# EAGLE design 640mk4 (EAGLE 7.5.0)
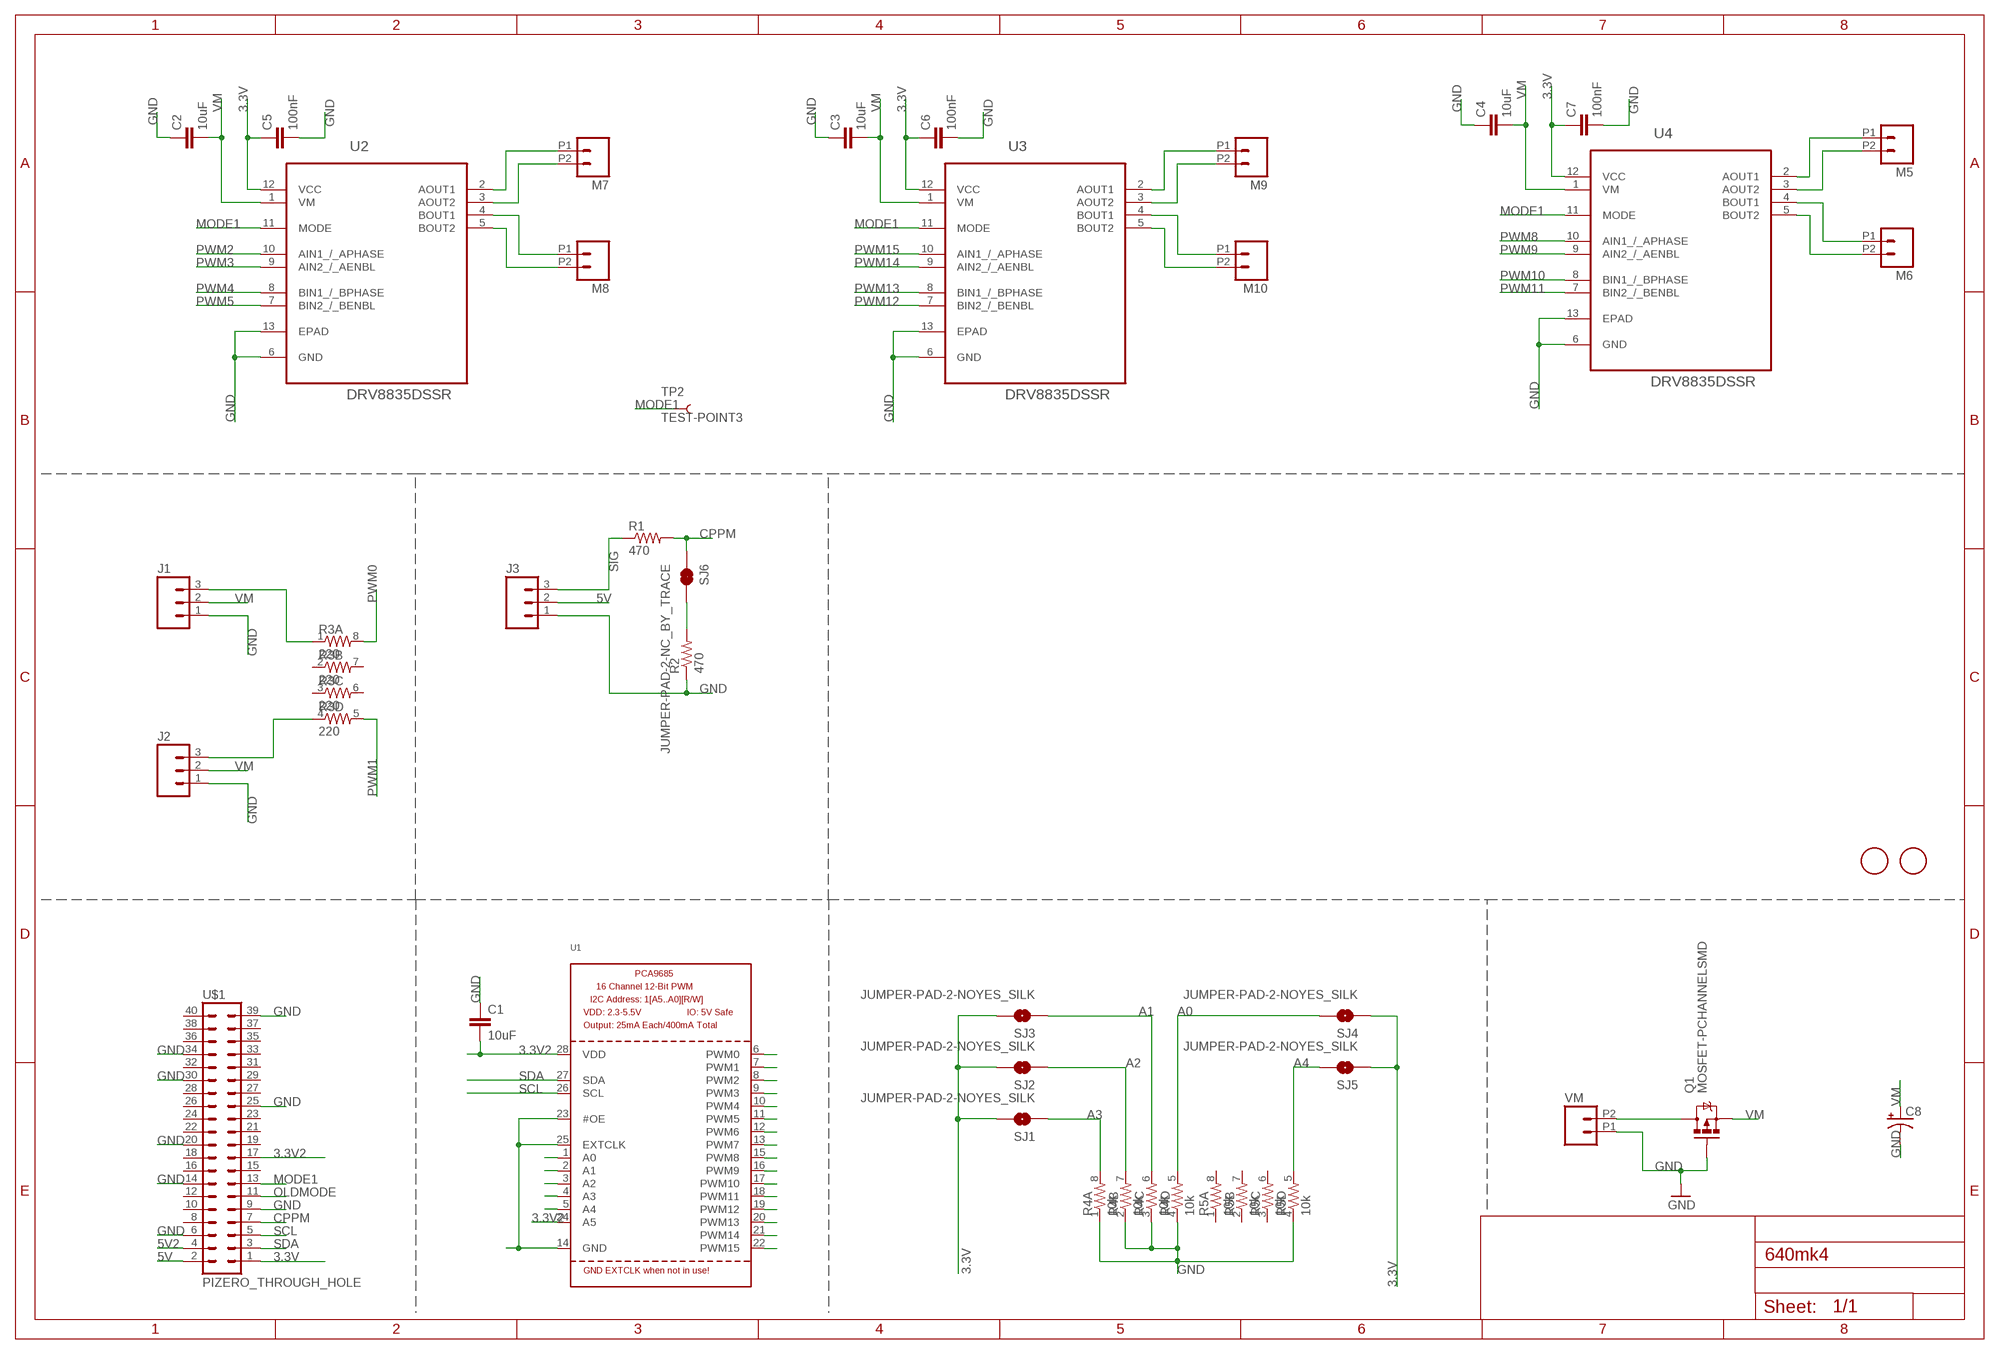
[diagram p0: schematic, sheet 1]

## Parts
C1  10uF  CAP0805  [0805]
C2  10uF  CAP0805  [0805]
C3  10uF  CAP0805  [0805]
C4  10uF  CAP0805  [0805]
C5  100nF  CAP0805  [0805]
C6  100nF  CAP0805  [0805]
C7  100nF  CAP0805  [0805]
C8  CAP_POLPTH1  [CPOL-RADIAL-100UF-25V]
FID1  FIDUCIAL  [FIDUCIAL_1MM]
FID2  FIDUCIAL  [FIDUCIAL_1MM]
J1  M03LOCK  [1X03_LOCK]
J2  M03LOCK  [1X03_LOCK]
J3  M03LOCK  [1X03_LOCK]
M5  M022.54MM_SCREWTERM  [1X02_2.54_SCREWTERM]
M6  M022.54MM_SCREWTERM  [1X02_2.54_SCREWTERM]
M7  M022.54MM_SCREWTERM  [1X02_2.54_SCREWTERM]
M8  M022.54MM_SCREWTERM  [1X02_2.54_SCREWTERM]
M9  M022.54MM_SCREWTERM  [1X02_2.54_SCREWTERM]
M10  M022.54MM_SCREWTERM  [1X02_2.54_SCREWTERM]
Q1  MOSFET-PCHANNELSMD  [SOT23-3]
R1  470  RESISTOR0805-RES  [0805]
R2  470  RESISTOR0805-RES  [0805]
R3  220  RESISTOR-ARRAY0603-ARV  [0603-ARV]
R4  10k  RESISTOR-ARRAY0603-ARV  [0603-ARV]
R5  10k  RESISTOR-ARRAY0603-ARV  [0603-ARV]
SJ1  JUMPER-PAD-2-NOYES_SILK  [PAD-JUMPER-2-NO_YES_SILK]
SJ2  JUMPER-PAD-2-NOYES_SILK  [PAD-JUMPER-2-NO_YES_SILK]
SJ3  JUMPER-PAD-2-NOYES_SILK  [PAD-JUMPER-2-NO_YES_SILK]
SJ4  JUMPER-PAD-2-NOYES_SILK  [PAD-JUMPER-2-NO_YES_SILK]
SJ5  JUMPER-PAD-2-NOYES_SILK  [PAD-JUMPER-2-NO_YES_SILK]
SJ6  JUMPER-PAD-2-NC_BY_TRACE  [PAD-JUMPER-2-NC_BY_TRACE_YES_SILK]
TP2  TEST-POINT3  [PAD.03X.03]
U1  PCA9685  [TSSOP28]
U2  DRV8835DSSR  [SON50P200X300X80-13N]
U3  DRV8835DSSR  [SON50P200X300X80-13N]
U4  DRV8835DSSR  [SON50P200X300X80-13N]
U$1  PIZERO_THROUGH_HOLE  [PIZERO_THOUGH_HOLE]
VM  M022.54MM_SCREWTERM  [1X02_2.54_SCREWTERM]

## Nets
3.3V: C5.1 C6.1 C7.1 SJ1.2 SJ2.2 SJ3.2 SJ4.1 SJ5.1 U2.12(VCC) U3.12(VCC) U4.12(VCC) U$1.1
3.3V2: C1.2 U1.24(A5) U1.28(VDD) U$1.17
5V: J3.2 U$1.2
5V2: U$1.4
A0: R4.5 SJ4.2 U1.1(A0)
A1: R4.6 SJ3.1 U1.2(A1)
A2: R4.7 SJ2.1 U1.3(A2)
A3: R4.8 SJ1.1 U1.4(A3)
A4: R5.5 SJ5.2 U1.5(A4)
CPPM: R1.2 SJ6.1 U$1.7
GND: C1.1 C2.1 C3.1 C4.1 C5.2 C6.2 C7.2 C8.2(-) J1.1 J2.1 J3.1 Q1.1(G) R2.1 R4.1 R4.2 R4.3 R4.4 R5.4 U1.14(GND) U1.23(#OE) U1.25(EXTCLK) U2.6(GND) U2.13(EPAD) U3.6(GND) U3.13(EPAD) U4.6(GND) U4.13(EPAD) U$1.6 U$1.9 U$1.14 U$1.20 U$1.25 U$1.30 U$1.34 U$1.39 VM.P1
MODE1: TP2.P$1 U2.11(MODE) U3.11(MODE) U4.11(MODE) U$1.13
N$1: R2.2 SJ6.2
N$2: J2.3 R3.4
N$4: J1.3 R3.1
N$5: Q1.3(D) VM.P2
N$10: M6.P2 U4.5(BOUT2)
N$11: M6.P1 U4.4(BOUT1)
N$12: M5.P2 U4.3(AOUT2)
N$13: M5.P1 U4.2(AOUT1)
N$14: M8.P2 U2.5(BOUT2)
N$15: M8.P1 U2.4(BOUT1)
N$16: M7.P2 U2.3(AOUT2)
N$17: M7.P1 U2.2(AOUT1)
N$18: M10.P2 U3.5(BOUT2)
N$19: M10.P1 U3.4(BOUT1)
N$20: M9.P2 U3.3(AOUT2)
N$21: M9.P1 U3.2(AOUT1)
OLDMODE: U$1.11
PWM0: R3.8 U1.6(PWM0)
PWM1: R3.5 U1.7(PWM1)
PWM2: U1.8(PWM2) U2.10(AIN1_/_APHASE)
PWM3: U1.9(PWM3) U2.9(AIN2_/_AENBL)
PWM4: U1.10(PWM4) U2.8(BIN1_/_BPHASE)
PWM5: U1.11(PWM5) U2.7(BIN2_/_BENBL)
PWM6: U1.12(PWM6)
PWM7: U1.13(PWM7)
PWM8: U1.15(PWM8) U4.10(AIN1_/_APHASE)
PWM9: U1.16(PWM9) U4.9(AIN2_/_AENBL)
PWM10: U1.17(PWM10) U4.8(BIN1_/_BPHASE)
PWM11: U1.18(PWM11) U4.7(BIN2_/_BENBL)
PWM12: U1.19(PWM12) U3.7(BIN2_/_BENBL)
PWM13: U1.20(PWM13) U3.8(BIN1_/_BPHASE)
PWM14: U1.21(PWM14) U3.9(AIN2_/_AENBL)
PWM15: U1.22(PWM15) U3.10(AIN1_/_APHASE)
SCL: U1.26(SCL) U$1.5
SDA: U1.27(SDA) U$1.3
SIG: J3.3 R1.1
VM: C2.2 C3.2 C4.2 C8.1(+) J1.2 J2.2 Q1.2(S) U2.1(VM) U3.1(VM) U4.1(VM)
Unconnected: R3.2 R3.3 R3.6 R3.7 R5.1 R5.2 R5.3 R5.6 R5.7 R5.8 U$1.8 U$1.10 U$1.12 U$1.15 U$1.16 U$1.18 U$1.19 U$1.21 U$1.22 U$1.23 U$1.24 U$1.26 U$1.27 U$1.28 U$1.29 U$1.31 U$1.32 U$1.33 U$1.35 U$1.36 U$1.37 U$1.38 U$1.40

## Library data of the parts
C1-C7 = SparkFun-Passives:CAP: Capacitor Standard 0603 ceramic capacitor, and 0.1" leaded capacitor.
C8 = SparkFun-Passives:CAP_POL: Capacitor Polarized These are standard SMD and PTH capacitors. Normally 10uF, 47uF, and 100uF in electrolytic and tantalum varieties. Always verify the external diameter of the through hole cap, it varies with capacity, voltage, and manufacturer. The EIA devices should be standard.
FID1 FID2 = adafruit:FIDUCIAL: For use by pick and place machines to calibrate the vision/machine, 1mm By microbuilder.eu
J1-J3 = SparkFun-Connectors:M03: Header 3 Standard 3-pin 0.1" header. Use with straight break away headers (SKU : PRT-00116), right angle break away headers (PRT-00553), swiss pins (PRT-00743), machine pins (PRT-00117), and female headers (PRT-00115). Molex polarized connector foot print use with SKU : PRT-08232 with associated crimp pins and housings.
M5-M10 VM = SparkFun-Connectors:M02: Standard 2-pin 0.1" header. Use with - straight break away headers ( PRT-00116) - right angle break away headers (PRT-00553) - swiss pins (PRT-00743) - machine pins (PRT-00117) - female headers (PRT-00115) Molex polarized connector foot print use with: PRT-08233 with associated crimp pins and housings. 2.54_SCREWTERM for use with PRT-10571. 3.5mm Screw Terminal footprints for PRT-08084 5mm Screw Terminal footprints for use with PRT-08432
Q1 = SparkFun-DiscreteSemi:MOSFET-PCHANNEL: Generic PMOSFET IRLML2244 - TRANS-11153 (SOT-23 -20V -4.3A) (1.Gate 2.Source 3.Drain) FQP27P06 - COM-10349 <http://www.sparkfun.com/products/10349> (TO-220 -60V -27A) (1.Gate 2.Source 3.Drain)
R1 R2 = SparkFun-Passives:RESISTOR: Resistor Basic schematic elements and footprints for 0603, 1206, and PTH resistors.
R3-R5 = SparkFun-Passives:RESISTOR-ARRAY: Array Chip Resistor Source: RS Component / Phycomp
SJ1-SJ5 = SparkFun-Passives:JUMPER-PAD-2-NO
SJ6 = SparkFun-Passives:JUMPER-PAD-2-NC_BY_TRACE
TP2 = SparkFun-Passives:TEST-POINT: Bare copper test points for troubleshooting or ICT
U1 = adafruit:PCA9685: PCA9685 - 16 Channel 12-Bit I2C PWM Controller 5.0V tolerant 16 channel, 12-bit I2C PWM controller with 25mA per output (max. 400mA total) Digikey: 568-5931-1-ND
U2-U4 = drv8835:DRV8835DSSR: DUAL LOW VOLTAGE H-BRIDGE IC,SON-12; MPN: DRV8835DSSR; OC_FARNELL: 2115235; OC_NEWARK: 94T6065; PACKAGE: SON-12; SUPPLIER: TEXAS INSTRUMENTS
U$1 = pizero:PIZERO_THROUGH_HOLE

## Board
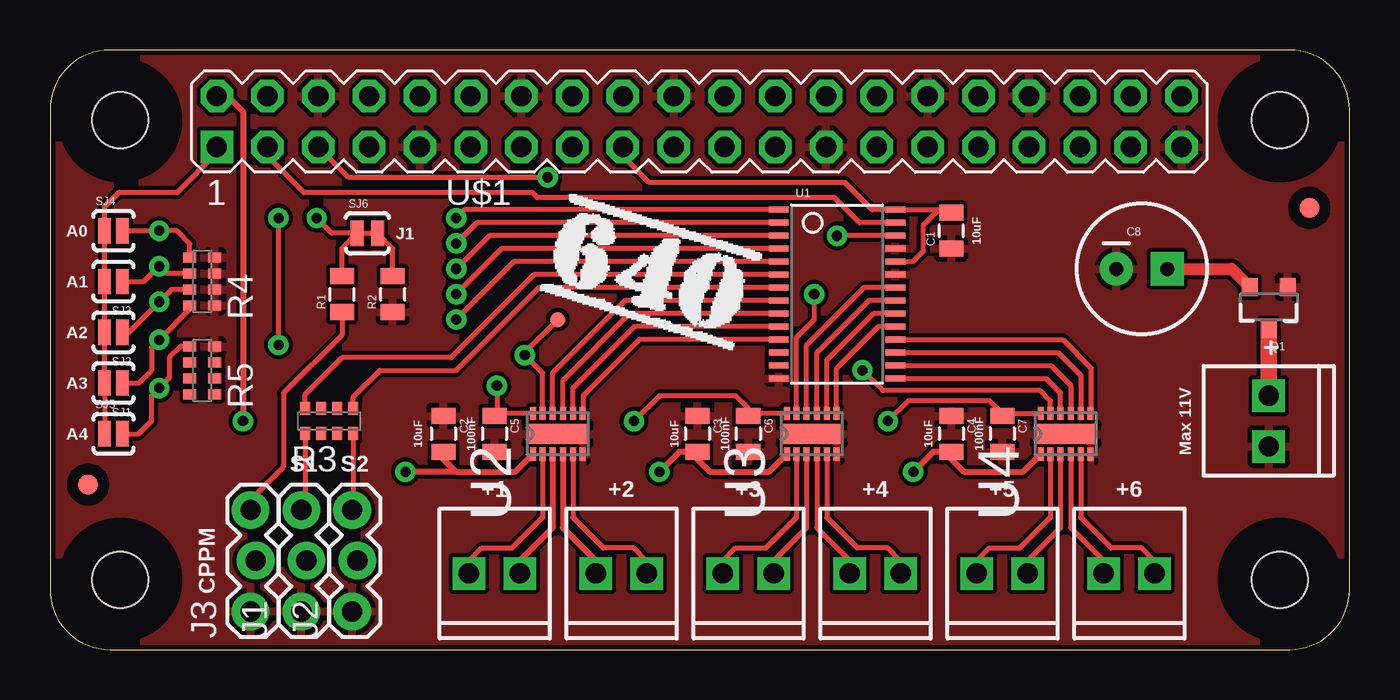
[diagram p1: board, top side]
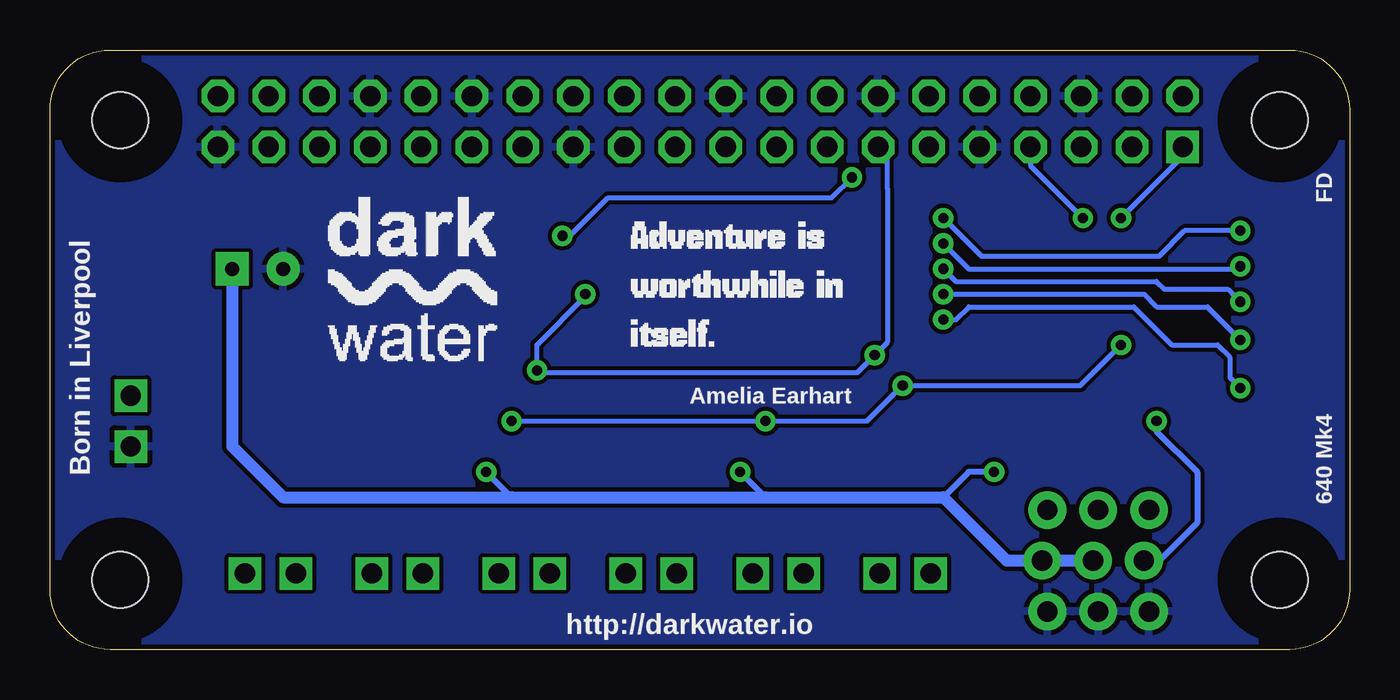
[diagram p2: board, bottom side, seen from below]

Size 65 x 30 mm. Coordinates in mm from the lower left corner, seen from the top.
Copper layers (1*16): Top 0.035mm / dielectric 1.5mm / Bottom 0.035mm
Design rules "SparkFun": minimum track width 8mil, minimum drill 20mil, track to track 8mil, track to pad 8mil, pad to pad 8mil, via to via 8mil, smd to smd 8mil, copper to edge 10mil, drill to drill 8mil, minimum pad ring 12mil, minimum via ring 10mil, stop-mask expansion 4mil, vias tented up to drill 25mil, thermal gap 10mil

### Footprints (pad centres in the part's own frame; a part is rotated, then mirrored left to right if it is on the bottom)
0805 = smd 0.8 x 1.2: 1 -0.9,0; 2 0.9,0
CPOL-RADIAL-100UF-25V = drill 0.7 pad 1.651 square: 1 1.27,0 | drill 0.7 pad 1.651: 2 -1.27,0
FIDUCIAL_1MM = smd 1 x 1: 1 0,0
1X03_LOCK = drill 1.016 pad 1.88: 1 0,0.127; 2 2.54,-0.127; 3 5.08,0.127
1X02_2.54_SCREWTERM = drill 1.016 square: P1 2.54,0; P2 0,0
SOT23-3 = smd 0.8 x 0.9: 1 -0.95,-1; 2 0.95,-1; 3 0,1.1
0603-ARV = smd 0.5 x 0.65: 1 -1.2,-0.625; 2 -0.4,-0.625; 3 0.4,-0.625; 4 1.2,-0.625; 5 1.2,0.625; 6 0.4,0.625; 7 -0.4,0.625; 8 -1.2,0.625
PAD-JUMPER-2-NO_YES_SILK = smd 0.635 x 1.27: 1 -0.45,0; 2 0.45,0
PAD-JUMPER-2-NC_BY_TRACE_YES_SILK = smd 0.635 x 1.27: 1 -0.508,0; 2 0.508,0
PAD.03X.03 = smd 0.762 x 0.762: P$1 0,0
TSSOP28 = smd 0.305 x 0.991: 1 -4.225,-2.918; 2 -3.575,-2.918; 3 -2.925,-2.918; 4 -2.275,-2.918; 5 -1.625,-2.918; 6 -0.975,-2.918; 7 -0.325,-2.918; 8 0.325,-2.918; 9 0.975,-2.918; 10 1.625,-2.918; 11 2.275,-2.918; 12 2.925,-2.918; 13 3.575,-2.918; 14 4.225,-2.918; 15 4.225,2.918; 16 3.575,2.918; 17 2.925,2.918; 18 2.275,2.918; 19 1.625,2.918; 20 0.975,2.918; 21 0.325,2.918; 22 -0.325,2.918; 23 -0.975,2.918; 24 -1.625,2.918; 25 -2.275,2.918; 26 -2.925,2.918; 27 -3.575,2.918; 28 -4.225,2.918
SON50P200X300X80-13N = smd 0.66 x 0.305: 1 -1.016,1.245; 2 -1.016,0.762; 3 -1.016,0.254; 4 -1.016,-0.254; 5 -1.016,-0.762; 6 -1.016,-1.245; 7 1.016,-1.245; 8 1.016,-0.762; 9 1.016,-0.254; 10 1.016,0.254; 11 1.016,0.762; 12 1.016,1.245 | smd 0.991 x 3.099: 13 0,0
PIZERO_THOUGH_HOLE = drill 1.016 square: 1 8.34,25.15 | drill 1.016 octagon: 2 8.34,27.69; 3 10.88,25.15; 4 10.88,27.69; 5 13.42,25.15; 6 13.42,27.69; 7 15.96,25.15; 8 15.96,27.69; 9 18.5,25.15; 10 18.5,27.69; 11 21.04,25.15; 12 21.04,27.69; 13 23.58,25.15; 14 23.58,27.69; 15 26.12,25.15; 16 26.12,27.69; 17 28.66,25.15; 18 28.66,27.69; 19 31.2,25.15; 20 31.2,27.69; 21 33.74,25.15; 22 33.74,27.69; 23 36.28,25.15; 24 36.28,27.69; 25 38.82,25.15; 26 38.82,27.69; 27 41.36,25.15; 28 41.36,27.69; 29 43.9,25.15; 30 43.9,27.69; 31 46.44,25.15; 32 46.44,27.69; 33 48.98,25.15; 34 48.98,27.69; 35 51.52,25.15; 36 51.52,27.69; 37 54.06,25.15; 38 54.06,27.69; 39 56.6,25.15; 40 56.6,27.69 | hole 2.8: 3.5,3.5; 3.5,26.5; 61.5,26.5; 61.5,3.5

### Placement (x,y rotation side)
C1  45.09,20.95 90 top
C2  19.68,10.79 270 top
C3  32.38,10.79 270 top
C4  45.09,10.79 270 top
C5  22.23,10.79 270 top
C6  34.92,10.79 270 top
C7  47.62,10.79 270 top
C8  54.61,19.05 0 top
FID1  1.91,8.26 0 top
FID2  62.99,22.1 0 top
J1  12.7,1.91 90 top
J2  15.24,1.91 90 top
J3  10.16,1.91 90 top
M5  48.9,3.81 180 top
M6  55.24,3.81 180 top
M7  23.5,3.81 180 top
M8  29.84,3.81 180 top
M9  36.2,3.81 180 top
M10  42.55,3.81 180 top
Q1  60.96,17.14 180 top
R1  14.61,17.78 90 top
R2  17.14,17.78 90 top
R3  13.97,11.43 0 top
R4  7.62,18.41 90 top
R5  7.62,13.97 90 top
SJ1  3.17,13.34 180 top
SJ2  3.17,15.88 180 top
SJ3  3.17,18.41 180 top
SJ4  3.17,20.95 0 top
SJ5  3.17,10.79 0 top
SJ6  15.88,20.83 0 top
TP2  25.4,16.51 0 top
U1  39.37,17.78 270 top
U2  25.4,10.79 90 top
U3  38.1,10.79 90 top
U4  50.8,10.79 90 top
U$1  0,0 0 top
U$4  [DARKWATER]  51.05,14.48 0 bottom
U$5  [ADVENTURE]  37.34,14.35 0 bottom
U$6  [640SMALL]  23.37,13.59 0 top
VM  60.96,12.7 270 top

### Tracks (layer width: path | path; a pad name or v marks a point on that pad's centre or on a via)
3.3V  (via drill 0.51)
  Top 0.254: U2.12 22.34,11.81 C5.1 22.35,11.82 v22.35,13.21 | U3.12 35.04,11.81 C6.1 34.91,12.08 34.29,12.7 30.48,12.7 v29.21,11.43 | SJ5.1 SJ1.2 SJ2.2 SJ3.2 SJ4.1 2.73,22.16 3.43,22.86 6.35,22.86 8.34,24.85 U$1.1 | U4.12 47.74,11.81 C7.1 47.62,11.81 46.99,12.45 42.93,12.45 v41.91,11.43 | v11.43,15.24 v11.43,21.59
  Bottom 0.254: v41.91,11.43 v29.21,11.43 24.13,11.43 v22.35,13.21 13.46,13.21 v11.43,15.24 | v11.43,21.59 8.34,24.68 U$1.1
3.3V2
  Top 0.254: 44.45,22 U1.28 41.11,22 39.75,23.37 29.97,23.37 28.66,24.68 U$1.17 | 44.45,22 44.94,22 C1.2 | U1.24 43.15,19.41 43.69,19.94 43.69,21.24 44.45,22
5V  (via drill 0.51)
  Top 0.305: U$1.2 8.89,27.69 9.65,26.92 v9.65,11.43
  Bottom 0.305: v9.65,11.43 9.65,10.92 7.62,8.89 7.62,6.35 9.53,4.45 J3.2
A0  (via drill 0.51)
  Top 0.254: 6.99,19.62 R4.5 7,20.31 6.35,20.95 v5.46,20.95 SJ4.2 | U1.1 20.73,22 v20.32,21.59
  Bottom 0.254: v20.32,21.59 18.41,19.68 9.53,19.68 8.26,20.95 v5.46,20.95
A1  (via drill 0.51)
  Top 0.254: SJ3.1 4.7,18.41 v5.46,19.18 5.82,18.82 R4.6 | U1.2 21.36,21.36 v20.32,20.32
  Bottom 0.254: v20.32,20.32 19.05,19.05 5.59,19.05 v5.46,19.18
A2  (via drill 0.51)
  Top 0.254: SJ2.1 3.94,15.88 v5.46,17.4 6.08,18.02 R4.7 | U1.3 21.98,20.7 v20.32,19.05
  Bottom 0.254: 5.84,17.78 v5.46,17.4 6.1,18.03 9.27,18.03 9.65,18.41 19.68,18.41 v20.32,19.05
A3  (via drill 0.51)
  Top 0.254: SJ1.1 4.45,13.34 5.08,13.97 5.08,15.11 v5.46,15.49 7,17.03 R4.8 | U1.4 22.59,20.05 v20.32,17.78
  Bottom 0.254: 6.6,16.64 v5.46,15.49 7.11,17.14 9.65,17.14 10.29,17.78 v20.32,17.78
A4  (via drill 0.51)
  Top 0.254: SJ5.2 4.45,10.79 5.08,11.43 5.08,12.7 v5.46,13.08 5.97,13.59 5.97,14.61 6.53,15.17 R5.5 | U1.5 23.21,19.41 v20.32,16.51
  Bottom 0.254: v5.46,13.08 5.97,13.59 5.97,14.61 6.6,15.24 8.89,15.24 10.79,17.14 19.05,17.14 19.68,16.51 v20.32,16.51
CPPM  (via drill 0.51)
  Top 0.254: R1.2 14.61,20.07 SJ6.1 14.1,20.83 v13.34,21.59
  Bottom 0.254: U$1.7 15.96,24.21 v13.34,21.59
GND
  pour Bottom: 0,27.3 0,2.54 arc90 2.54,0 62.23,0 arc90 64.77,2.54 64.77,27.3 arc90 62.23,29.84 2.54,29.84 arc90
  pour Top: 0,27.3 0,2.54 arc90 2.54,0 62.23,0 arc90 64.77,2.54 64.77,27.3 arc90 62.23,29.84 2.54,29.84 arc90
MODE1  (via drill 0.51)
  Top 0.254: U4.11 50.04,12.45 49.53,12.95 41.66,12.95 v40.64,13.97 | U3.11 37.34,15.62 38.23,16.51 v38.23,17.78 | U2.11 24.64,13.84 v23.75,14.73 23.75,14.86 TP2.P$1
  Bottom 0.254: v38.23,17.78 38.23,17.65 40.64,15.24 v40.64,13.97 40.51,13.84 24.64,13.84 v23.75,14.73 23.11,15.37 23.11,23.08 23.11,24.68 U$1.13
N$1
  Top 0.254: R2.2 17.14,20.07 SJ6.2
N$2
  Top 0.254: R3.4 15.17,7.04 J2.3
N$4
  Top 0.254: R3.1 12.77,7.18 J1.3
N$5
  Top 0.813: VM.P2 Q1.3
N$10
  Top 0.254: U4.5 51.56,6.6 53.09,5.08 54.61,5.08 55.24,4.45 M6.P2
N$11
  Top 0.254: U4.4 51.05,6.1 52.7,4.45 M6.P1
N$12
  Top 0.254: U4.3 50.55,6.1 48.9,4.45 M5.P2
N$13
  Top 0.254: U4.2 50.04,6.6 48.51,5.08 46.99,5.08 46.35,4.45 M5.P1
N$14
  Top 0.254: U2.5 26.16,6.6 27.69,5.08 29.21,5.08 29.84,4.45 M8.P2
N$15
  Top 0.305: U2.4 25.65,6.1 27.3,4.45 M8.P1
N$16
  Top 0.305: U2.3 25.15,6.1 23.5,4.45 M7.P2
N$17
  Top 0.254: U2.2 24.64,6.6 23.11,5.08 21.59,5.08 20.95,4.45 M7.P1
N$18
  Top 0.254: U3.5 38.86,6.6 40.39,5.08 41.91,5.08 42.55,4.45 M10.P2
N$19
  Top 0.254: U3.4 38.35,6.1 40.01,4.45 M10.P1
N$20
  Top 0.254: U3.3 37.85,6.1 36.2,4.45 M9.P2
N$21
  Top 0.254: U3.2 37.34,6.6 35.81,5.08 34.29,5.08 33.66,4.45 M9.P1
PWM0
  Top 0.254: U1.6 24.22,18.75 20.07,14.61 14.61,14.61 12.77,12.77 R3.8
PWM1
  Top 0.254: U1.7 24.45,18.11 20.32,13.97 16.51,13.97 15.17,12.63 R3.5
PWM2
  Top 0.254: U1.8 28.76,17.45 25.15,13.84 U2.10
PWM3
  Top 0.254: U1.9 29,16.8 25.65,13.46 U2.9
PWM4
  Top 0.254: U1.10 29.24,16.16 26.16,13.08 U2.8
PWM5
  Top 0.254: U1.11 29.48,15.51 26.67,12.7 26.67,11.84 U2.7
PWM8
  Top 0.254: U1.15 49.82,13.55 50.55,12.83 U4.10
PWM9
  Top 0.254: U1.16 50.06,14.21 51.05,13.21 U4.9
PWM10
  Top 0.254: U1.17 50.42,14.86 51.56,13.72 U4.8
PWM11
  Top 0.254: U1.18 50.66,15.51 52.07,14.1 52.07,11.84 U4.7
PWM12
  Top 0.254: U1.19 41.43,16.16 39.34,14.07 U3.7
PWM13
  Top 0.254: U1.20 41.19,16.8 38.86,14.48 U3.8
PWM14
  Top 0.254: U1.21 40.95,17.45 38.35,14.86 U3.9
PWM15
  Top 0.254: U1.22 40.71,18.11 37.85,15.24 U3.10
SCL  (via drill 0.51)
  Top 0.254: U1.26 v39.37,20.7 | v24.89,23.62 14.95,23.62 U$1.5
  Bottom 0.254: v39.37,20.7 38.99,20.7 37.08,22.61 25.91,22.61 v24.89,23.62
SDA
  Top 0.254: U1.27 40.49,21.36 39.24,22.61 24.38,22.61 24.13,22.86 12.7,22.86 10.88,24.68 U$1.3
SIG
  Top 0.254: J3.3 10.03,7.49 11.68,9.14 11.68,12.83 14.61,15.75 R1.1
VM  (via drill 0.51)
  Top 0.305: v43.18,8.89 44.19,9.89 C4.2 45.09,9.53 45.72,8.89 48.67,8.89 U4.1 | v30.48,8.89 31.48,9.89 C3.2 32.38,9.53 33.02,8.89 35.97,8.89 U3.1 | C2.2 19.68,9.53 20.32,8.89 | 20.32,8.89 23.27,8.89 U2.1 | 20.32,8.89 v17.78,8.89
  Top 0.61: C8.1 59.1,19.05 Q1.2
  Bottom 0.305: v43.18,8.89 41.91,7.62 | v30.48,8.89 29.21,7.62 | v17.78,8.89 19.05,8.89 20.32,7.62
  Bottom 0.61: C8.1 55.88,10.16 53.34,7.62 41.91,7.62 29.21,7.62 20.32,7.62 17.14,4.45 J2.2 J1.2

### Text on the board
tPlace: A0 | J1 | 10uF | A1 | A2 | + | A3 | A4 | 10uF | 100nF | 10uF | 100nF | 10uF | 100nF | Max 11V | S1 | S2 | +1 | +2 | +3 | +4 | +5 | +6 | CPPM
bPlace: FD | Born in Liverpool | Amelia Earhart | 640 Mk4 | http://darkwater.io